# Altium schematic sheet M1_CM4.SchDoc
size A3; SheetNumber: 1; SheetTotal: 5
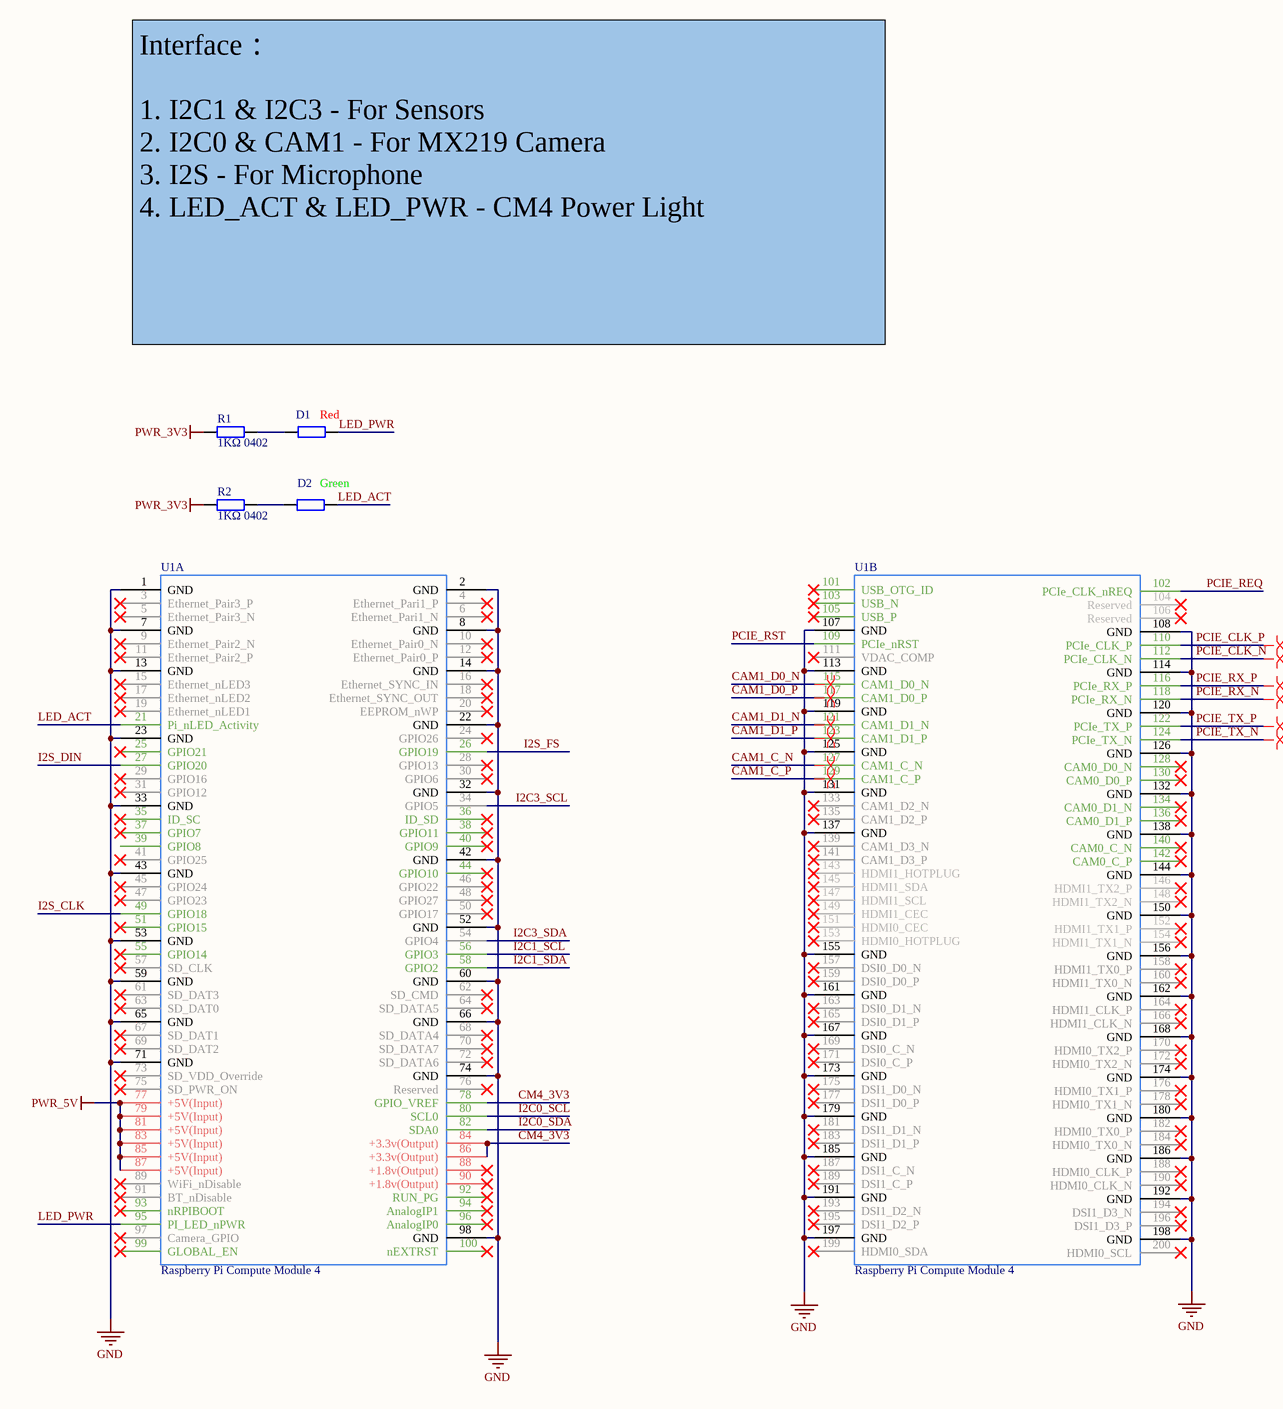
[diagram p0: M1_CM4.SchDoc]

## Parts
D1  Red  [0402_R]
D2  Green  [0402_R]
R1  1KΩ 0402  [0402_R]
R2  1KΩ 0402  [0402_R]
U1  Raspberry Pi Compute Module 4  [CM4T-DF40HC(3.0)-100DS]  (parts A,B of 2)

## Nets
GND: U1.1(GND) U1.2(GND) U1.7(GND) U1.8(GND) U1.13(GND) U1.14(GND) U1.22(GND) U1.23(GND) U1.32(GND) U1.33(GND) U1.42(GND) U1.43(GND) U1.52(GND) U1.53(GND) U1.59(GND) U1.60(GND) U1.65(GND) U1.66(GND) U1.71(GND) U1.74(GND) U1.98(GND) U1.107(GND) U1.108(GND) U1.113(GND) U1.114(GND) U1.119(GND) U1.120(GND) U1.125(GND) U1.126(GND) U1.131(GND) U1.132(GND) U1.137(GND) U1.138(GND) U1.144(GND) U1.150(GND) U1.155(GND) U1.156(GND) U1.161(GND) U1.162(GND) U1.167(GND) U1.168(GND) U1.173(GND) U1.174(GND) U1.179(GND) U1.180(GND) U1.185(GND) U1.186(GND) U1.191(GND) U1.192(GND) U1.197(GND) U1.198(GND)
PWR_3V3: R1.1 R2.1
PWR_5V: U1.77(+5V(Input)) U1.79(+5V(Input)) U1.81(+5V(Input)) U1.83(+5V(Input)) U1.85(+5V(Input)) U1.87(+5V(Input))
CAM1_C_N: U1.127(CAM1_C_N)
CAM1_C_P: U1.129(CAM1_C_P)
CAM1_D0_N: U1.115(CAM1_D0_N)
CAM1_D0_P: U1.117(CAM1_D0_P)
CAM1_D1_N: U1.121(CAM1_D1_N)
CAM1_D1_P: U1.123(CAM1_D1_P)
CM4_3V3: U1.78(GPIO_VREF) U1.84(+3.3v(Output)) U1.86(+3.3v(Output))
I2C0_SCL: U1.80(SCL0)
I2C0_SDA: U1.82(SDA0)
I2C1_SCL: U1.56(GPIO3)
I2C1_SDA: U1.58(GPIO2)
I2C3_SCL: U1.34(GPIO5)
I2C3_SDA: U1.54(GPIO4)
I2S_CLK: U1.49(GPIO18)
I2S_DIN: U1.27(GPIO20)
I2S_FS: U1.26(GPIO19)
LED_ACT: D2.2 U1.21(Pi_nLED_Activity)
LED_PWR: D1.2 U1.95(PI_LED_nPWR)
PCIE_CLK_N: U1.112(PCIe_CLK_N)
PCIE_CLK_P: U1.110(PCIe_CLK_P)
PCIE_REQ: U1.102(PCIe_CLK_nREQ)
PCIE_RST: U1.109(PCIe_nRST)
PCIE_RX_N: U1.118(PCIe_RX_N)
PCIE_RX_P: U1.116(PCIe_RX_P)
PCIE_TX_N: U1.124(PCIe_TX_N)
PCIE_TX_P: U1.122(PCIe_TX_P)
NetD1_1: D1.1 R1.2
NetD2_1: D2.1 R2.2

Not connected (* = marked no-connect by the designer): U1 3(Ethernet_Pair3_P)* 4(Ethernet_Pari1_P)* 5(Ethernet_Pair3_N)* 6(Ethernet_Pari1_N)* 9(Ethernet_Pair2_N)* 10(Ethernet_Pair0_N)* 11(Ethernet_Pair2_P)* 12(Ethernet_Pair0_P)* 15(Ethernet_nLED3)* 16(Ethernet_SYNC_IN)* 17(Ethernet_nLED2)* 18(Ethernet_SYNC_OUT)* 19(Ethernet_nLED1)* 20(EEPROM_nWP)* 24(GPIO26)* 25(GPIO21)* 28(GPIO13)* 29(GPIO16)* 30(GPIO6)* 31(GPIO12)* 35(ID_SC)* 36(ID_SD)* 37(GPIO7)* 38(GPIO11)* 39(GPIO8) 40(GPIO9)* 41(GPIO25)* 44(GPIO10)* 45(GPIO24)* 46(GPIO22)* 47(GPIO23)* 48(GPIO27)* 50(GPIO17)* 51(GPIO15)* 55(GPIO14)* 57(SD_CLK)* 61(SD_DAT3)* 62(SD_CMD)* 63(SD_DAT0)* 64(SD_DATA5)* 67(SD_DAT1)* 68(SD_DATA4)* 69(SD_DAT2)* 70(SD_DATA7)* 72(SD_DATA6)* 73(SD_VDD_Override)* 75(SD_PWR_ON)* 76(Reserved)* 88(+1.8v(Output))* 89(WiFi_nDisable)* 90(+1.8v(Output))* 91(BT_nDisable)* 92(RUN_PG)* 93(nRPIBOOT)* 94(AnalogIP1)* 96(AnalogIP0)* 97(Camera_GPIO)* 99(GLOBAL_EN)* 100(nEXTRST)* 101(USB_OTG_ID)* 103(USB_N)* 104(Reserved)* 105(USB_P)* 106(Reserved)* 111(VDAC_COMP)* 128(CAM0_D0_N)* 130(CAM0_D0_P)* 133(CAM1_D2_N)* 134(CAM0_D1_N)* 135(CAM1_D2_P)* 136(CAM0_D1_P)* 139(CAM1_D3_N)* 140(CAM0_C_N)* 141(CAM1_D3_P)* 142(CAM0_C_P)* 143(HDMI1_HOTPLUG)* 145(HDMI1_SDA)* 146(HDMI1_TX2_P)* 147(HDMI1_SCL)* 148(HDMI1_TX2_N)* 149(HDMI1_CEC)* 151(HDMI0_CEC)* 152(HDMI1_TX1_P)* 153(HDMI0_HOTPLUG)* 154(HDMI1_TX1_N)* 157(DSI0_D0_N)* 158(HDMI1_TX0_P)* 159(DSI0_D0_P)* 160(HDMI1_TX0_N)* 163(DSI0_D1_N)* 164(HDMI1_CLK_P)* 165(DSI0_D1_P)* 166(HDMI1_CLK_N)* 169(DSI0_C_N)* 170(HDMI0_TX2_P)* 171(DSI0_C_P)* 172(HDMI0_TX2_N)* 175(DSI1_D0_N)* 176(HDMI0_TX1_P)* 177(DSI1_D0_P)* 178(HDMI0_TX1_N)* 181(DSI1_D1_N)* 182(HDMI0_TX0_P)* 183(DSI1_D1_P)* 184(HDMI0_TX0_N)* 187(DSI1_C_N)* 188(HDMI0_CLK_P)* 189(DSI1_C_P)* 190(HDMI0_CLK_N)* 193(DSI1_D2_N)* 194(DSI1_D3_N)* 195(DSI1_D2_P)* 196(DSI1_D3_P)* 199(HDMI0_SDA)* 200(HDMI0_SCL)*

## Layout directives
differential pair: CAM1_C_N, CAM1_C_P, CAM1_D0_N, CAM1_D0_P, CAM1_D1_N, CAM1_D1_P, PCIE_CLK_N, PCIE_CLK_P, PCIE_RX_N, PCIE_RX_P, PCIE_TX_N, PCIE_TX_P

## Notes on the sheet
- Interface：
  1. I2C1 & I2C3 - For Sensors
  2. I2C0 & CAM1 - For MX219 Camera
  3. I2S - For Microphone
  4. LED_ACT & LED_PWR - CM4 Power Light

## Library data of the parts
D1 D2 = 0402 10KΩ (1002) 1%: 贴片电阻; ComponentLink1Description: 供应商链接; ComponentLink1URL: http://www.szlcsc.com/product/details_26487.html; Package: 0402; Supplier: LC; SuppliersPartNumber: C25744
R1 R2 = 0402 1KΩ (1001) 1%: 贴片电阻; ComponentLink1Description: 供应商链接; ComponentLink1URL: http://www.szlcsc.com/product/details_12256.html; Package: 0402; Supplier: LC; SuppliersPartNumber: C11702
U1 = CM4